# Altium schematic sheet POWER SWITCH AND LDO.SchDoc
size 420 x 297 mm; SheetNumber: 3; SheetTotal: 5
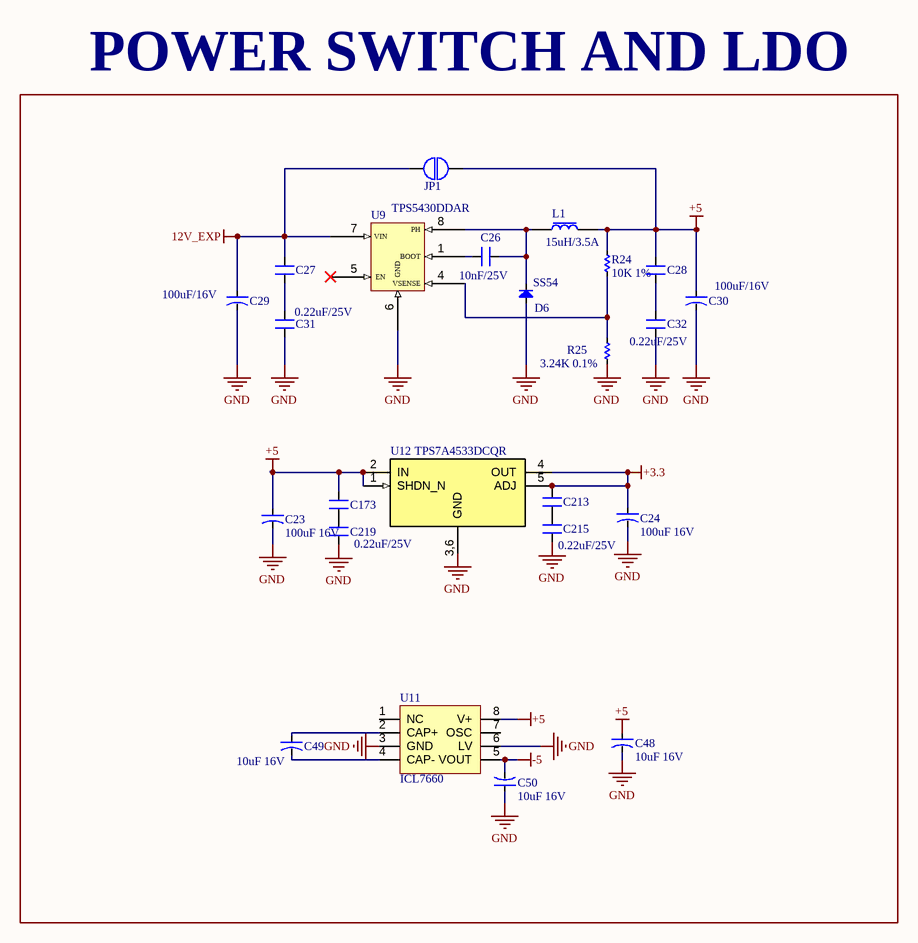
[diagram p0: POWER SWITCH AND LDO.SchDoc]

## Parts
C23  100uF 16V  [CAP TANT 2312]
C24  100uF 16V  [CAP TANT 2312]
C26  10nF/25V  [CN-SMD-0603]
C27  0.22uF/25V  [CN-SMD-0603]  (value not drawn)
C28  0.22uF/25V  [CN-SMD-0603]  (value not drawn)
C29  100uF/16V  [CAP TANT 2312]
C30  100uF/16V  [CAP TANT 2312]
C31  0.22uF/25V  [CN-SMD-0603]
C32  0.22uF/25V  [CN-SMD-0603]
C48  10uF 16V  [CAP_TANT_1206]
C49  10uF 16V  [CAP_TANT_1206]
C50  10uF 16V  [CAP_TANT_1206]
C173  0.22uF/25V  [CN-SMD-0603]
C213  0.22uF/25V  [CN-SMD-0603]  (value not drawn)
C215  0.22uF/25V  [CN-SMD-0603]
C219  0.22uF/25V  [CN-SMD-0603]  (value not drawn)
D6  SS54  [DIO-SMD-A]
JP1  JUMP2  [Jump2]  (value not drawn)
L1  15uH/3.5A  [SRP7050TA]
R24  10K 1%  [RES-SMD-0603]
R25  3.24K 0.1%  [RES-SMD-0603]
U9  TPS5430DDAR  [HSOP8]
U11  ICL7660  [SO8]
U12  TPS7A4533DCQR  [SOT223-6]

## Blocks framed on the sheet
POWER SWITCH AND LDO: C23 C24 C26-C32 C48-C50 C173 C213 C215 C219 D6 JP1 L1 R24 R25 U9 U11 U12

## Nets
12V_EXP: C27.2 C29.1 JP1.1 U9.7(VIN)
+3.3: C24.1 C213.2 U12.4(OUT) U12.5(ADJ)
+5: C23.1 C28.2 C30.1 C48.1 C173.2 JP1.2 L1.2 R24.2 U11.8(V+) U12.1(SHDN_N) U12.2(IN)
-5: C50.2 U11.5(VOUT)
GND: C23.2 C24.2 C29.2 C30.2 C31.1 C32.1 C48.2 C50.1 C215.1 C219.1 D6.1(A) R25.1 U9.6(GND) U11.3(GND) U11.6(LV) U12.3,6(GND)
NetC26_1: C26.1 D6.2(K) L1.1 U9.8(PH)
NetC26_2: C26.2 U9.1(BOOT)
NetC27_1: C27.1 C31.2
NetC28_1: C28.1 C32.2
NetC49_1: C49.1 U11.2(CAP+)
NetC49_2: C49.2 U11.4(CAP-)
NetC173_1: C173.1 C219.2
NetC213_1: C213.1 C215.2
NetR24_1: R24.1 R25.2 U9.4(VSENSE)

Not connected (* = marked no-connect by the designer): U9 5(EN)*; U11 1(NC) 7(OSC)

## Notes on the sheet
- Project:
- BEE-PC1
- Sub-system:
- Design by:
- Hung Nguyen D.
- Bao Bui Q.
- Sheet title:
- Sheet
- A3
- of
- Checked by:
- Approved by:
- Vu Pham
- Revision:
- Document No:
- V1.1.1
- Size:
- Date:

## Library data of the parts
C23 C24 C29 C30 C48-C50 = CN-ALU-SMD: Polarized Capacitor (Axial); Published: 8-Jun-2000; LatestRevisionDate: 17-Jul-2002; LatestRevisionNote: Re-released for DXP Platform.; PackageReference: POLAR0.8; Publisher: Altium Limited
C26-C28 C31 C32 C173 C213 C215 C219 = CM: 0603; Value: 103
D6 = Diode SMD: DIODE SCHOTTKY 40V 5A SMA; Code - JEDEC: DO-214-AB; Value: 1N5007; Published: 8-Jun-2000; Revision: July-2002: Re-released for DXP Platform.; Publisher: Altium Limited
L1 = INDUCTOR: SRP7050TA-150M
R24 = Res-SMD: 0603; Manufacturer: Generic Components; Class: Passive; Published: 08/06/2000; Publisher: Altium Hobart Technology Centre
R25 = Res-SMD: ERA-3AEB3241V; Manufacturer: Generic Components; Class: Passive; Published: 08/06/2000; Publisher: Altium Hobart Technology Centre
U9 = TPS543X: 8SOP; pin to pad: 6>6+9
U11 = ICL7660: CMOS Voltage Converters; Creator: Nguyen Ba Bien
U12 = TPS7A4533DCQR: IC REG LINEAR 3.3V 1.5A SOT223-6